# Altium schematic sheet Pwr.SchDoc
size A3; SheetNumber: 3; SheetTotal: 4
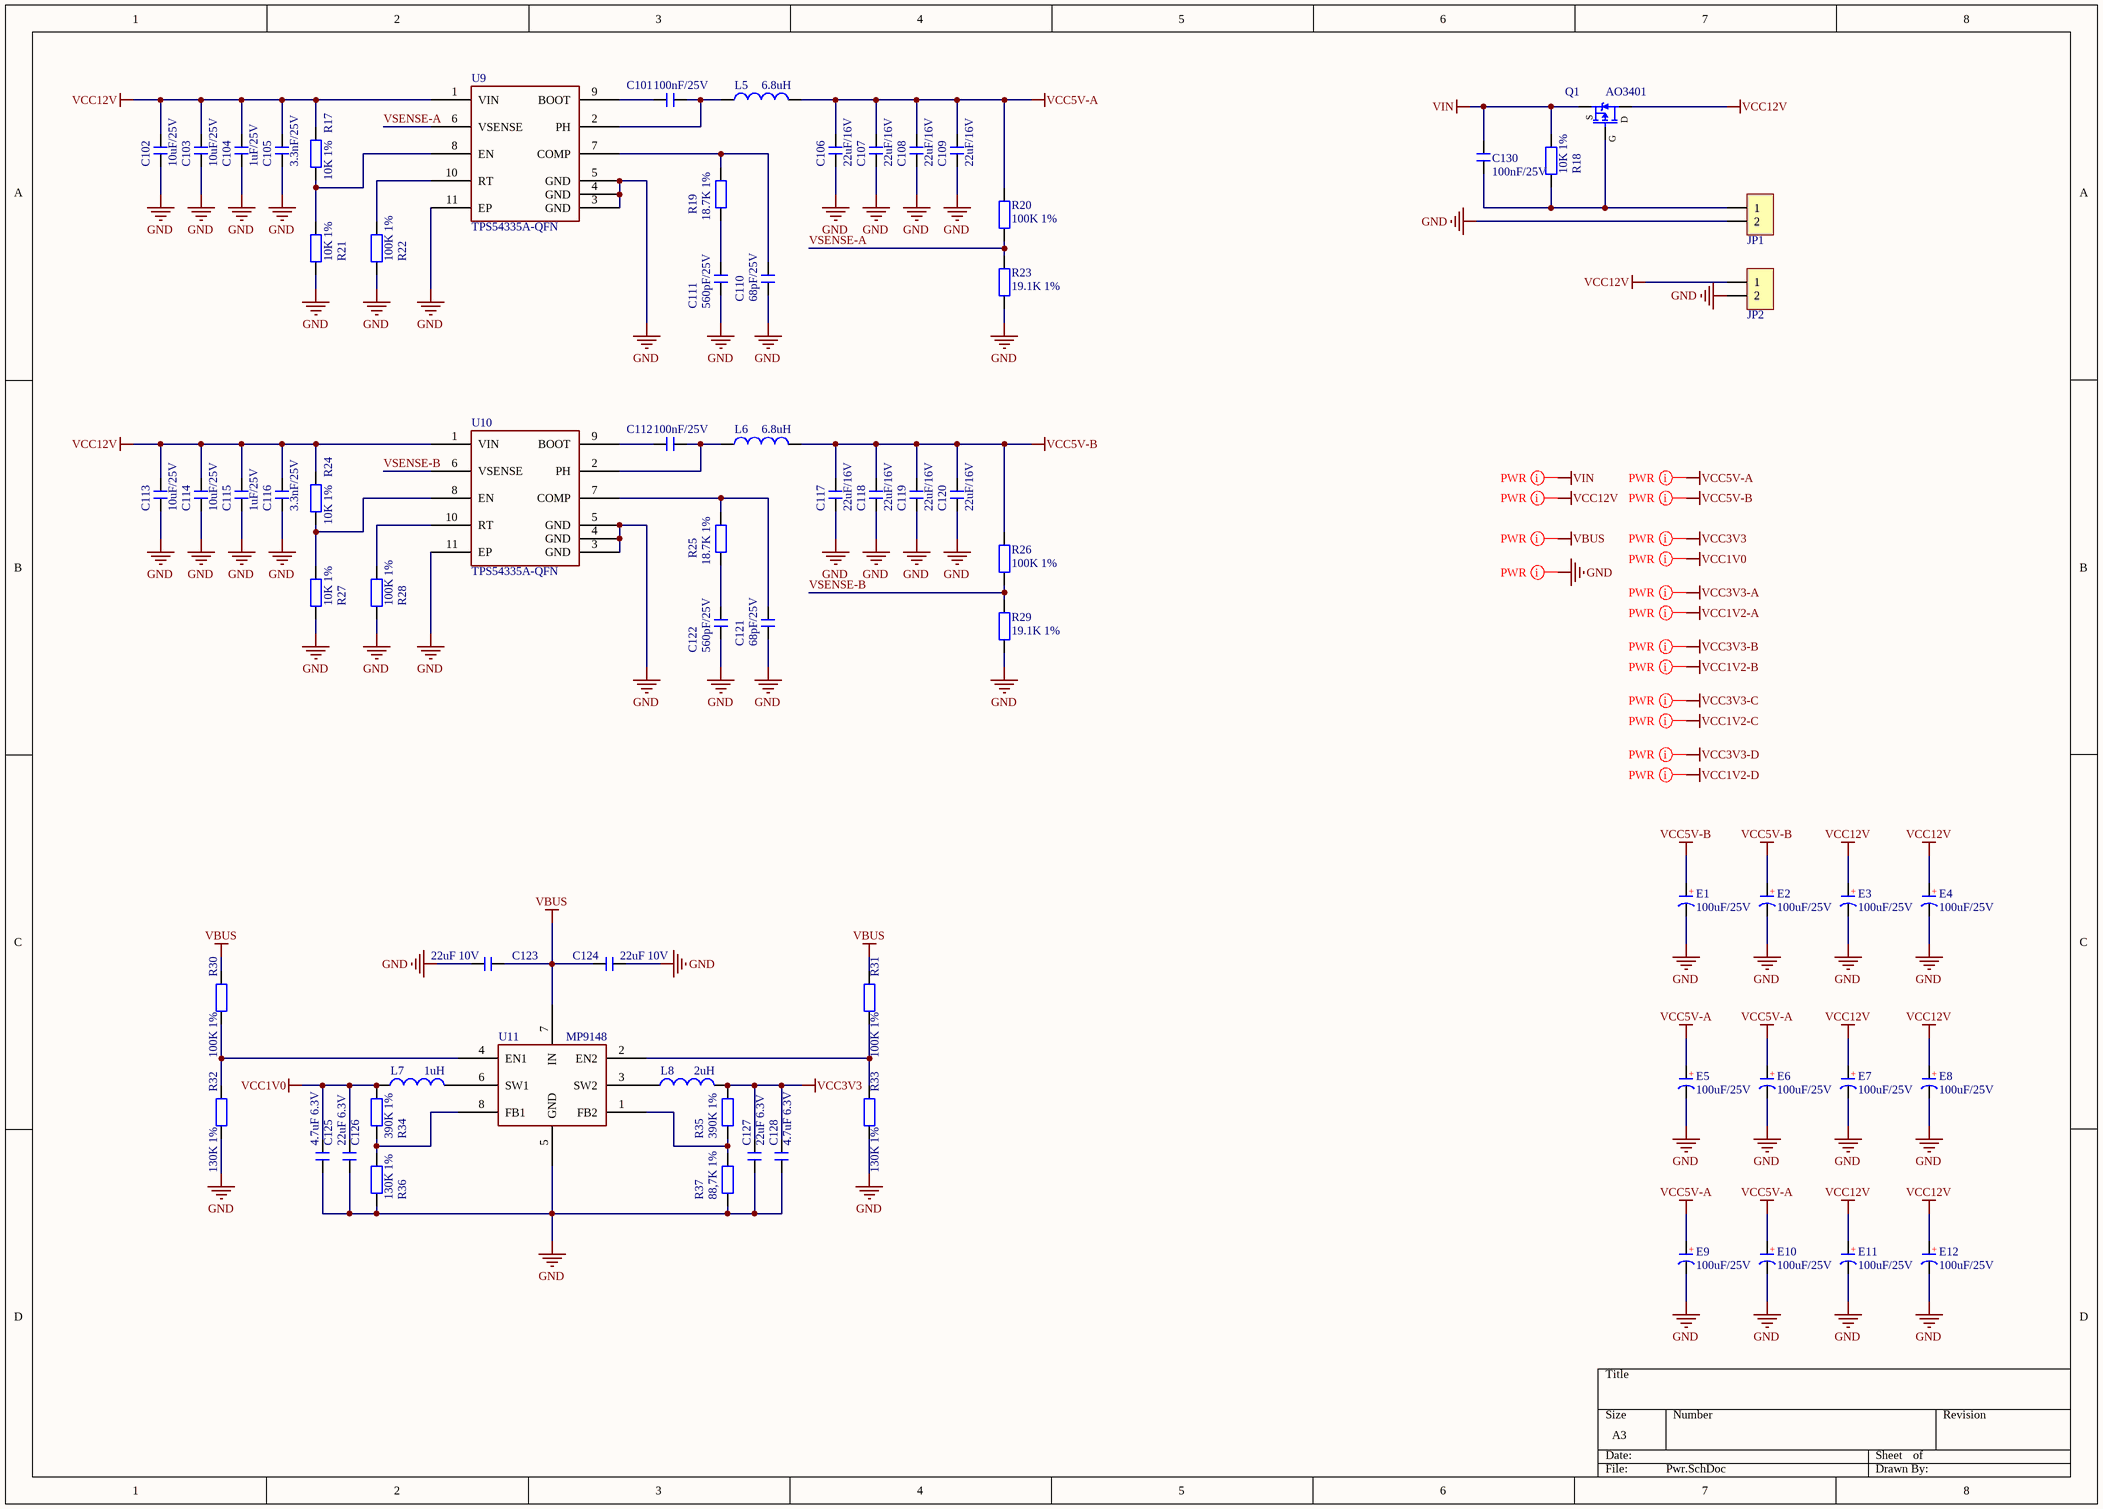
[diagram p0: Pwr.SchDoc]

## Parts
C101  100nF/25V  [C0402_L]
C102  10uF/25V  [C0603_L]
C103  10uF/25V  [C0603_L]
C104  1uF/25V  [C0603_L]
C105  3.3nF/25V  [C0603_L]
C106  22uF/16V  [C0603_L]
C107  22uF/16V  [C0603_L]
C108  22uF/16V  [C0603_L]
C109  22uF/16V  [C0603_L]
C110  68pF/25V  [C0402_L]
C111  560pF/25V  [C0402_L]
C112  100nF/25V  [C0402_L]
C113  10uF/25V  [C0603_L]
C114  10uF/25V  [C0603_L]
C115  1uF/25V  [C0603_L]
C116  3.3nF/25V  [C0603_L]
C117  22uF/16V  [C0603_L]
C118  22uF/16V  [C0603_L]
C119  22uF/16V  [C0603_L]
C120  22uF/16V  [C0603_L]
C121  68pF/25V  [C0402_L]
C122  560pF/25V  [C0402_L]
C123  22uF 10V  [C0603_L]
C124  22uF 10V  [C0603_L]
C125  4.7uF 6.3V  [C0603_L]
C126  22uF 6.3V  [C0603_L]
C127  22uF 6.3V  [C0603_L]
C128  4.7uF 6.3V  [C0603_L]
C130  100nF/25V  [C0402_L]
E1  100uF/25V  [CS 6*4 - B]
E2  100uF/25V  [CS 6*4 - B]
E3  100uF/25V  [CS 6*4 - B]
E4  100uF/25V  [CS 6*4 - B]
E5  100uF/25V  [CS 6*4 - B]
E6  100uF/25V  [CS 6*4 - B]
E7  100uF/25V  [CS 6*4 - B]
E8  100uF/25V  [CS 6*4 - B]
E9  100uF/25V  [CS 6*4 - B]
E10  100uF/25V  [CS 6*4 - B]
E11  100uF/25V  [CS 6*4 - B]
E12  100uF/25V  [CS 6*4 - B]
JP1  HDR-1X2  [ZH1.5-WS-2P]  (value not drawn)
JP2  HDR-1X2  [XH2.54-WS-2P]  (value not drawn)
L5  6.8uH  [NR4020]
L6  6.8uH  [NR4020]
L7  1uH  [NR4020]
L8  2uH  [NR4020]
Q1  AO3401  [DFN8-L3.0-W3.0-P0.65_EP]
R17  10K 1%  [R0402_L]
R18  10K 1%  [R0402_L]
R19  18.7K 1%  [R0402_L]
R20  100K 1%  [R0402_L]
R21  10K 1%  [R0402_L]
R22  100K 1%  [R0402_L]
R23  19.1K 1%  [R0402_L]
R24  10K 1%  [R0402_L]
R25  18.7K 1%  [R0402_L]
R26  100K 1%  [R0402_L]
R27  10K 1%  [R0402_L]
R28  100K 1%  [R0402_L]
R29  19.1K 1%  [R0402_L]
R30  100K 1%  [R0402_L]
R31  100K 1%  [R0402_L]
R32  130K 1%  [R0402_L]
R33  130K 1%  [R0402_L]
R34  390K 1%  [R0402_L]
R35  390K 1%  [R0402_L]
R36  130K 1%  [R0402_L]
R37  88,7K 1%  [R0402_L]
U9  TPS54335A-QFN  [VSON-10_L3.0-W3.0-P0.50-TL-EP]
U10  TPS54335A-QFN  [VSON-10_L3.0-W3.0-P0.50-TL-EP]
U11  MP9148  [SOT23-8]

## Nets
GND: C102.1 C103.1 C104.1 C105.1 C106.1 C107.1 C108.1 C109.1 C110.1 C111.1 C113.1 C114.1 C115.1 C116.1 C117.1 C118.1 C119.1 C120.1 C121.1 C122.1 C123.1 C124.1 C125.1 C126.1 C127.1 C128.1 E1.2(K) E2.2(K) E3.2(K) E4.2(K) E5.2(K) E6.2(K) E7.2(K) E8.2(K) E9.2(K) E10.2(K) E11.2(K) E12.2(K) JP1.2 JP2.2 R21.2 R22.2 R23.2 R27.2 R28.2 R29.2 R32.2 R33.2 R36.2 R37.2 U9.3(GND) U9.4(GND) U9.5(GND) U9.11(EP) U10.3(GND) U10.4(GND) U10.5(GND) U10.11(EP) U11.5(GND)
VBUS: C123.2 C124.2 R30.1 R31.1 U11.7(IN)
VCC1V0: C125.2 C126.2 L7.1 R34.1
VCC3V3: C127.2 C128.2 L8.1 R35.1
VCC5V-A: C106.2 C107.2 C108.2 C109.2 E5.1(A) E6.1(A) E9.1(A) E10.1(A) L5.2 R20.1
VCC5V-B: C117.2 C118.2 C119.2 C120.2 E1.1(A) E2.1(A) L6.2 R26.1
VCC12V: C102.2 C103.2 C104.2 C105.2 C113.2 C114.2 C115.2 C116.2 E3.1(A) E4.1(A) E7.1(A) E8.1(A) E11.1(A) E12.1(A) JP2.1 Q1.3(D) R17.1 R24.1 U9.1(VIN) U10.1(VIN)
VIN: C130.1 Q1.2(S) R18.1
VSENSE-A: R20.2 R23.1 U9.6(VSENSE)
VSENSE-B: R26.2 R29.1 U10.6(VSENSE)
NetC101_1: C101.1 L5.1 U9.2(PH)
NetC101_2: C101.2 U9.9(BOOT)
NetC110_2: C110.2 R19.1 U9.7(COMP)
NetC111_2: C111.2 R19.2
NetC112_1: C112.1 L6.1 U10.2(PH)
NetC112_2: C112.2 U10.9(BOOT)
NetC121_2: C121.2 R25.1 U10.7(COMP)
NetC122_2: C122.2 R25.2
NetC130_2: C130.2 JP1.1 Q1.1(G) R18.2
NetL7_2: L7.2 U11.6(SW1)
NetL8_2: L8.2 U11.3(SW2)
NetR17_2: R17.2 R21.1 U9.8(EN)
NetR22_1: R22.1 U9.10(RT)
NetR24_2: R24.2 R27.1 U10.8(EN)
NetR28_1: R28.1 U10.10(RT)
NetR30_2: R30.2 R32.1 U11.4(EN1)
NetR31_2: R31.2 R33.1 U11.2(EN2)
NetR34_2: R34.2 R36.1 U11.8(FB1)
NetR35_2: R35.2 R37.1 U11.1(FB2)

## Layout directives
net class PWR; rule Width Constraint [Pref Width = 8mil    Min Width = 6mil    Max Width = 50mil]: GND, VBUS, VCC1V0, VCC1V2-A, VCC1V2-B, VCC1V2-C, VCC1V2-D, VCC3V3, VCC3V3-A, VCC3V3-B, VCC3V3-D, VCC5V-A, VCC5V-B, VCC12V, VIN
net class PWR: VCC3V3-C

## Notes on the sheet
- Labels drawn without touching a wire or pin: GND, VBUS, VCC1V0, VCC1V2-A, VCC1V2-B, VCC1V2-C, VCC1V2-D, VCC3V3, VCC3V3-A, VCC3V3-B, VCC3V3-C, VCC3V3-D, VCC5V-A, VCC5V-B, VCC12V, VIN
- (in symbol C-CD) +

## Library data of the parts
C101-C128 C130 = C: 无极性贴片电容; 版权归属: 源创客; 材质: X7R; BOM名称: 无极性贴片电容; 学习资源: www.ooocke.com
E1-E12 = C-CD: 贴片钽电容; 版权归属: 源创客; BOM名称: 贴片钽电容; 学习资源: www.ooocke.com
JP1 JP2 = Header 2: 2P接插件; 版权归属: 源创客; BOM名称: 2P接插件; 学习资源: www.ooocke.com
L5-L8 = L: 小功率贴片电感; 版权归属: 源创客; BOM名称: 小功率贴片电感; 学习资源: www.ooocke.com
Q1 = AO3401: P沟道 30V/4.2A; BOM名称: 场效应管; 版权归属: 源创客; 学习资源: www.ooocke.com; 描述: P沟道 30V/4.2A
R17-R37 = R: 贴片电阻; 版权归属: 源创客; BOM名称: 贴片电阻; 学习资源: www.ooocke.com
U9 U10 = TPS54335A-QFN: BUCK
U11 = MP9148: BUCK